# EAGLE schematic Flight-Mill-Controller (EAGLE 9.6.2)

## Sheet 1 of 3
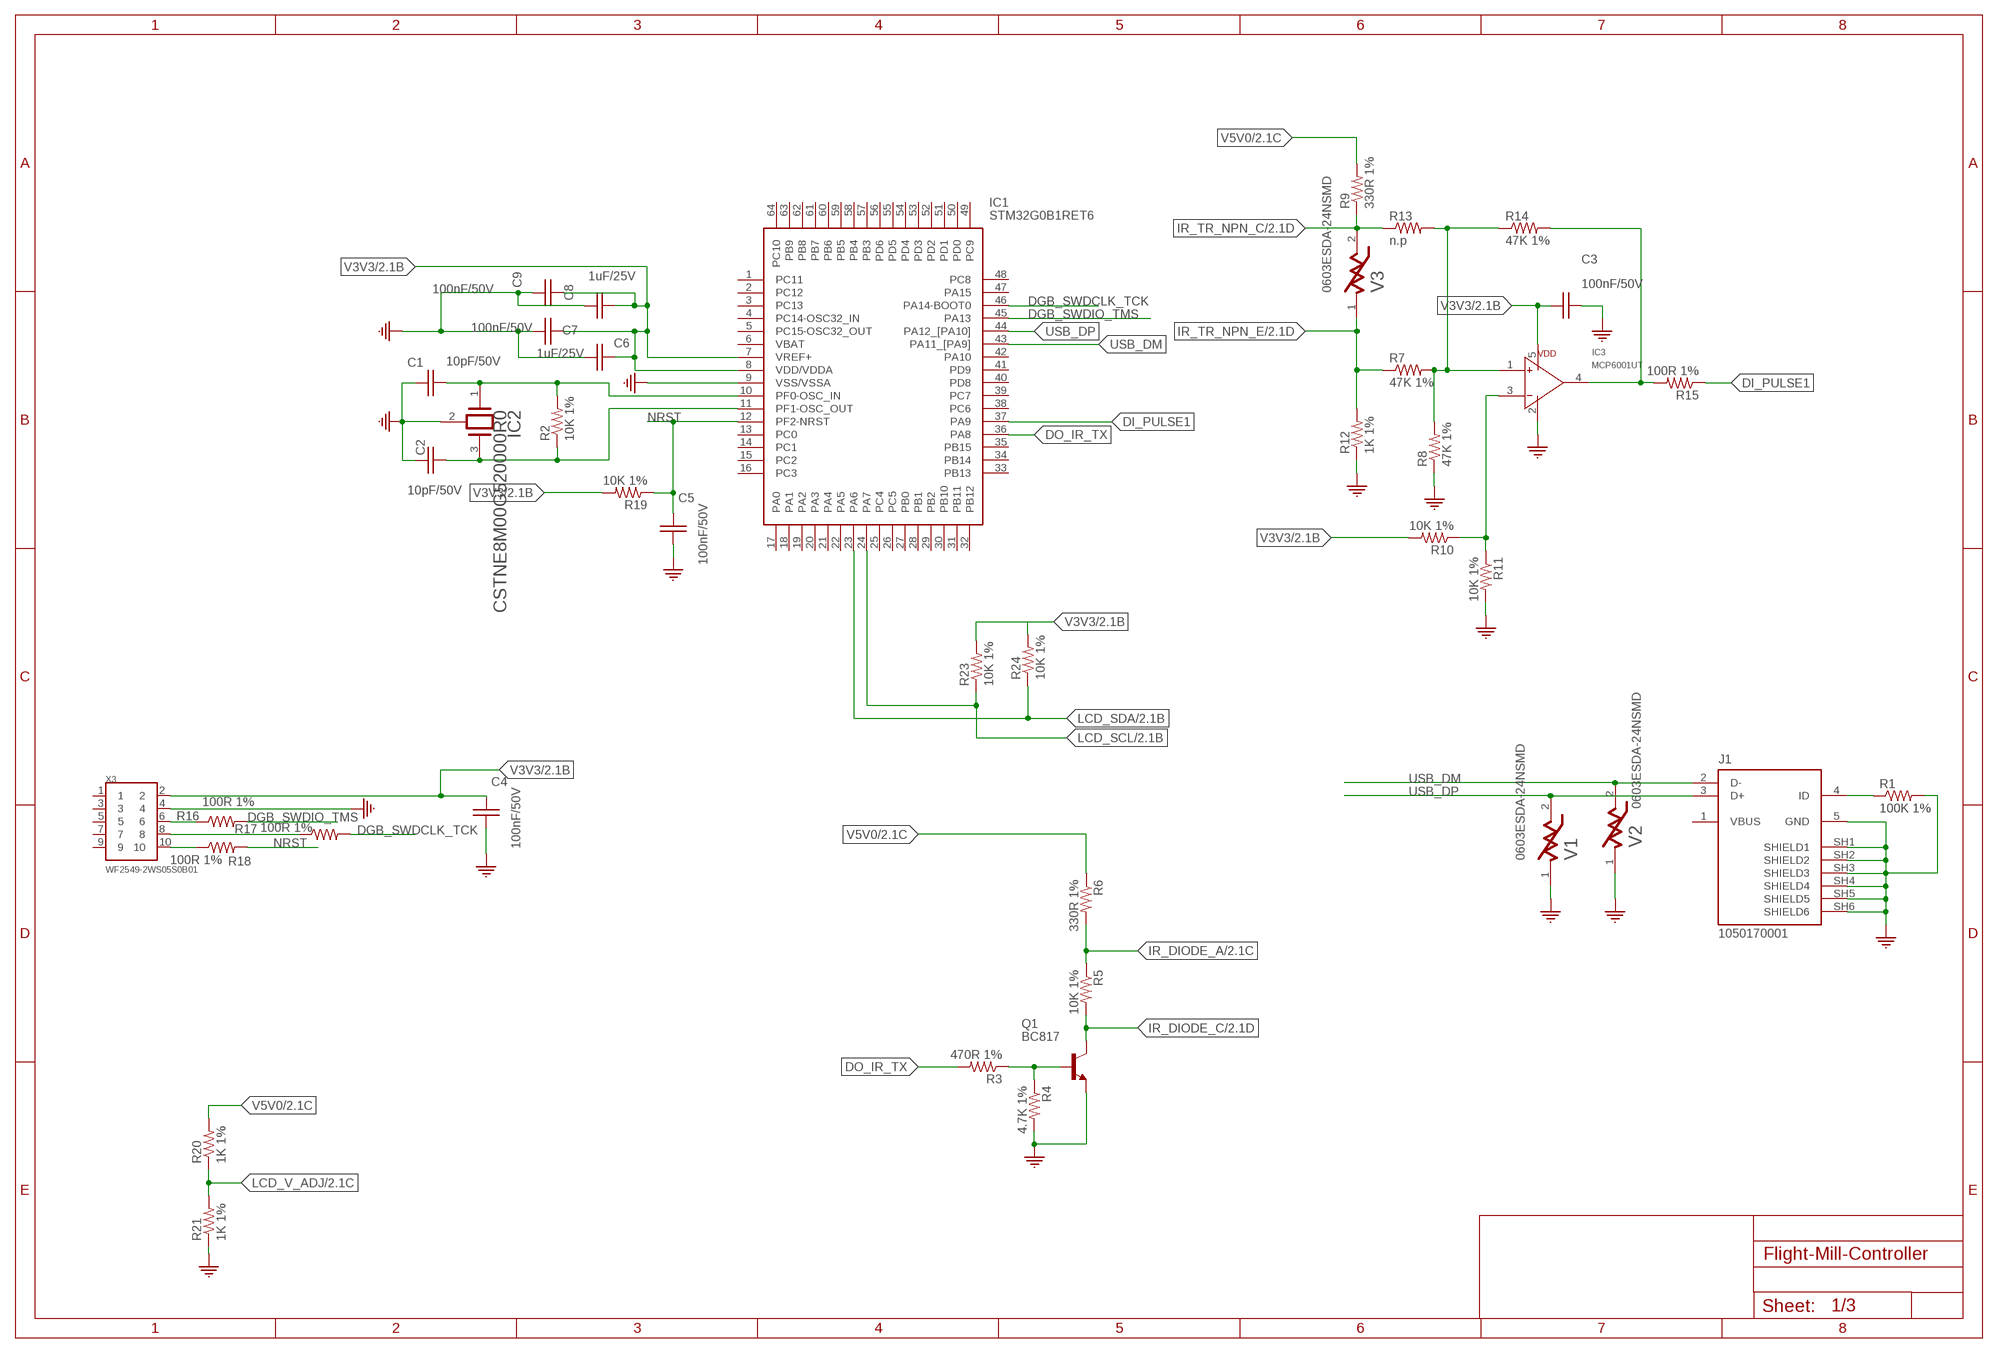
[diagram p0: schematic, sheet 1]

### Parts
C1  10pF/50V  C_0603EIA0603  [EIA0603]
C2  10pF/50V  C_0603EIA0603  [EIA0603]
C3  100nF/50V  C_0603EIA0603  [EIA0603]
C4  100nF/50V  C_0603EIA0603  [EIA0603]
C5  100nF/50V  C_0603EIA0603  [EIA0603]
C6  1uF/25V  C_0603EIA0603  [EIA0603]
C7  100nF/50V  C_0603EIA0603  [EIA0603]
C8  1uF/25V  C_0603EIA0603  [EIA0603]
C9  100nF/50V  C_0603EIA0603  [EIA0603]
IC1  STM32G0B1RET6  [QFP50P1200X1200X160-64N]
IC2  CSTNE8M00G520000R0  [CSTNE8M00G520000R0]
IC3  MCP6001UT  [SOT-23-5]
J1  1050170001  [MOLEX_1050170001]
Q1  BC817  [SOT23]
R1  100K 1%  R_0603  [EIA0603]
R2  10K 1%  R_0603  [EIA0603]
R3  470R 1%  R_0603  [EIA0603]
R4  4.7K 1%  R_0603  [EIA0603]
R5  10K 1%  R_0603  [EIA0603]
R6  330R 1%  R_0603  [EIA0603]
R7  47K 1%  R_0603  [EIA0603]
R8  47K 1%  R_0603  [EIA0603]
R9  330R 1%  R_0603  [EIA0603]
R10  10K 1%  R_0603  [EIA0603]
R11  10K 1%  R_0603  [EIA0603]
R12  1K 1%  R_0603  [EIA0603]
R13  n.p  R_0603  [EIA0603]
R14  47K 1%  R_0603  [EIA0603]
R15  100R 1%  R_0603  [EIA0603]
R16  100R 1%  R_0603  [EIA0603]
R17  100R 1%  R_0603  [EIA0603]
R18  100R 1%  R_0603  [EIA0603]
R19  10K 1%  R_0603  [EIA0603]
R20  1K 1%  R_0603  [EIA0603]
R21  1K 1%  R_0603  [EIA0603]
R23  10K 1%  R_0603  [EIA0603]
R24  10K 1%  R_0603  [EIA0603]
V1  0603ESDA-24NSMD  [EIA0603]
V2  0603ESDA-24NSMD  [EIA0603]
V3  0603ESDA-24NSMD  [EIA0603]
X3  WF2549-2WS05S0B01  [X10_100MIL_2XROW_VERT]

### Nets
DGB_SWDCLK_TCK: IC1.46(PA14-BOOT0) R17.2
DGB_SWDIO_TMS: IC1.45(PA13) R16.2
DI_PULSE1: IC1.37(PA9) R15.1
DO_IR_TX: IC1.36(PA8) R3.2
GND: C1.1 C2.1 C3.2 C4.1 C5.1 C6.2 C7.2 C8.2 C9.2 IC1.9(VSS/VSSA) IC2.2(GND) IC3.2(NULL) J1.5(GND) J1.SH1(SHIELD1) J1.SH2(SHIELD2) J1.SH3(SHIELD3) J1.SH4(SHIELD4) J1.SH5(SHIELD5) J1.SH6(SHIELD6) Q1.2(E) R1.2 R4.2 R8.1 R11.2 R12.1 R21.1 V1.1 V2.1 X3.4 ; also sheet 2,3
IR_DIODE_A: R5.1 R6.2 ; also sheet 2
IR_DIODE_C: Q1.3(C) R5.2 ; also sheet 2
IR_TR_NPN_C: R9.1 R13.1 V3.2 ; also sheet 2
IR_TR_NPN_E: R7.1 R12.2 V3.1 ; also sheet 2
LCD_SCL: IC1.24(PA7) R23.1 ; also sheet 2
LCD_SDA: IC1.23(PA6) R24.1 ; also sheet 2
LCD_V_ADJ: R20.1 R21.2 ; also sheet 2
N$1: R16.1 X3.6
N$3: C1.2 IC1.10(PF0-OSC_IN) IC2.1(INPUT) R2.2
N$4: J1.4(ID) R1.1
N$5: C2.2 IC1.11(PF1-OSC_OUT) IC2.3(OUTPUT) R2.1
N$6: IC3.1(NULL) R7.2 R8.2 R13.2 R14.1
N$7: Q1.1(B) R3.1 R4.1
N$8: IC3.3(NULL) R10.1 R11.1
N$10: IC3.4(NULL) R14.2 R15.2
N$11: R17.1 X3.8
N$13: R18.1 X3.10
NRST: C5.2 IC1.12(PF2-NRST) R18.2 R19.1
USB_DM: IC1.43(PA11_[PA9]) J1.2(D-) V2.2
USB_DP: IC1.44(PA12_[PA10]) J1.3(D+) V1.2
V3V3: C3.1 C4.2 C6.1 C7.1 C8.1 C9.1 IC1.7(VREF+) IC1.8(VDD/VDDA) IC3.5(NULL) R10.2 R19.2 R23.2 R24.2 X3.2 ; also sheet 2
V5V0: R6.1 R9.2 R20.2 ; also sheet 2,3
Unconnected: IC1.1(PC11) IC1.2(PC12) IC1.3(PC13) IC1.4(PC14-OSC32_IN) IC1.5(PC15-OSC32_OUT) IC1.6(VBAT) IC1.13(PC0) IC1.14(PC1) IC1.15(PC2) IC1.16(PC3) IC1.17(PA0) IC1.18(PA1) IC1.19(PA2) IC1.20(PA3) IC1.21(PA4) IC1.22(PA5) IC1.25(PC4) IC1.26(PC5) IC1.27(PB0) IC1.28(PB1) IC1.29(PB2) IC1.30(PB10) IC1.31(PB11) IC1.32(PB12) IC1.33(PB13) IC1.34(PB14) IC1.35(PB15) IC1.38(PC6) IC1.39(PC7) IC1.40(PD8) IC1.41(PD9) IC1.42(PA10) IC1.47(PA15) IC1.48(PC8) IC1.49(PC9) IC1.50(PD0) IC1.51(PD1) IC1.52(PD2) IC1.53(PD3) IC1.54(PD4) IC1.55(PD5) IC1.56(PD6) IC1.57(PB3) IC1.58(PB4) IC1.59(PB5) IC1.60(PB6) IC1.61(PB7) IC1.62(PB8) IC1.63(PB9) IC1.64(PC10) X3.1 X3.3 X3.5 X3.7 X3.9

## Sheet 2 of 3
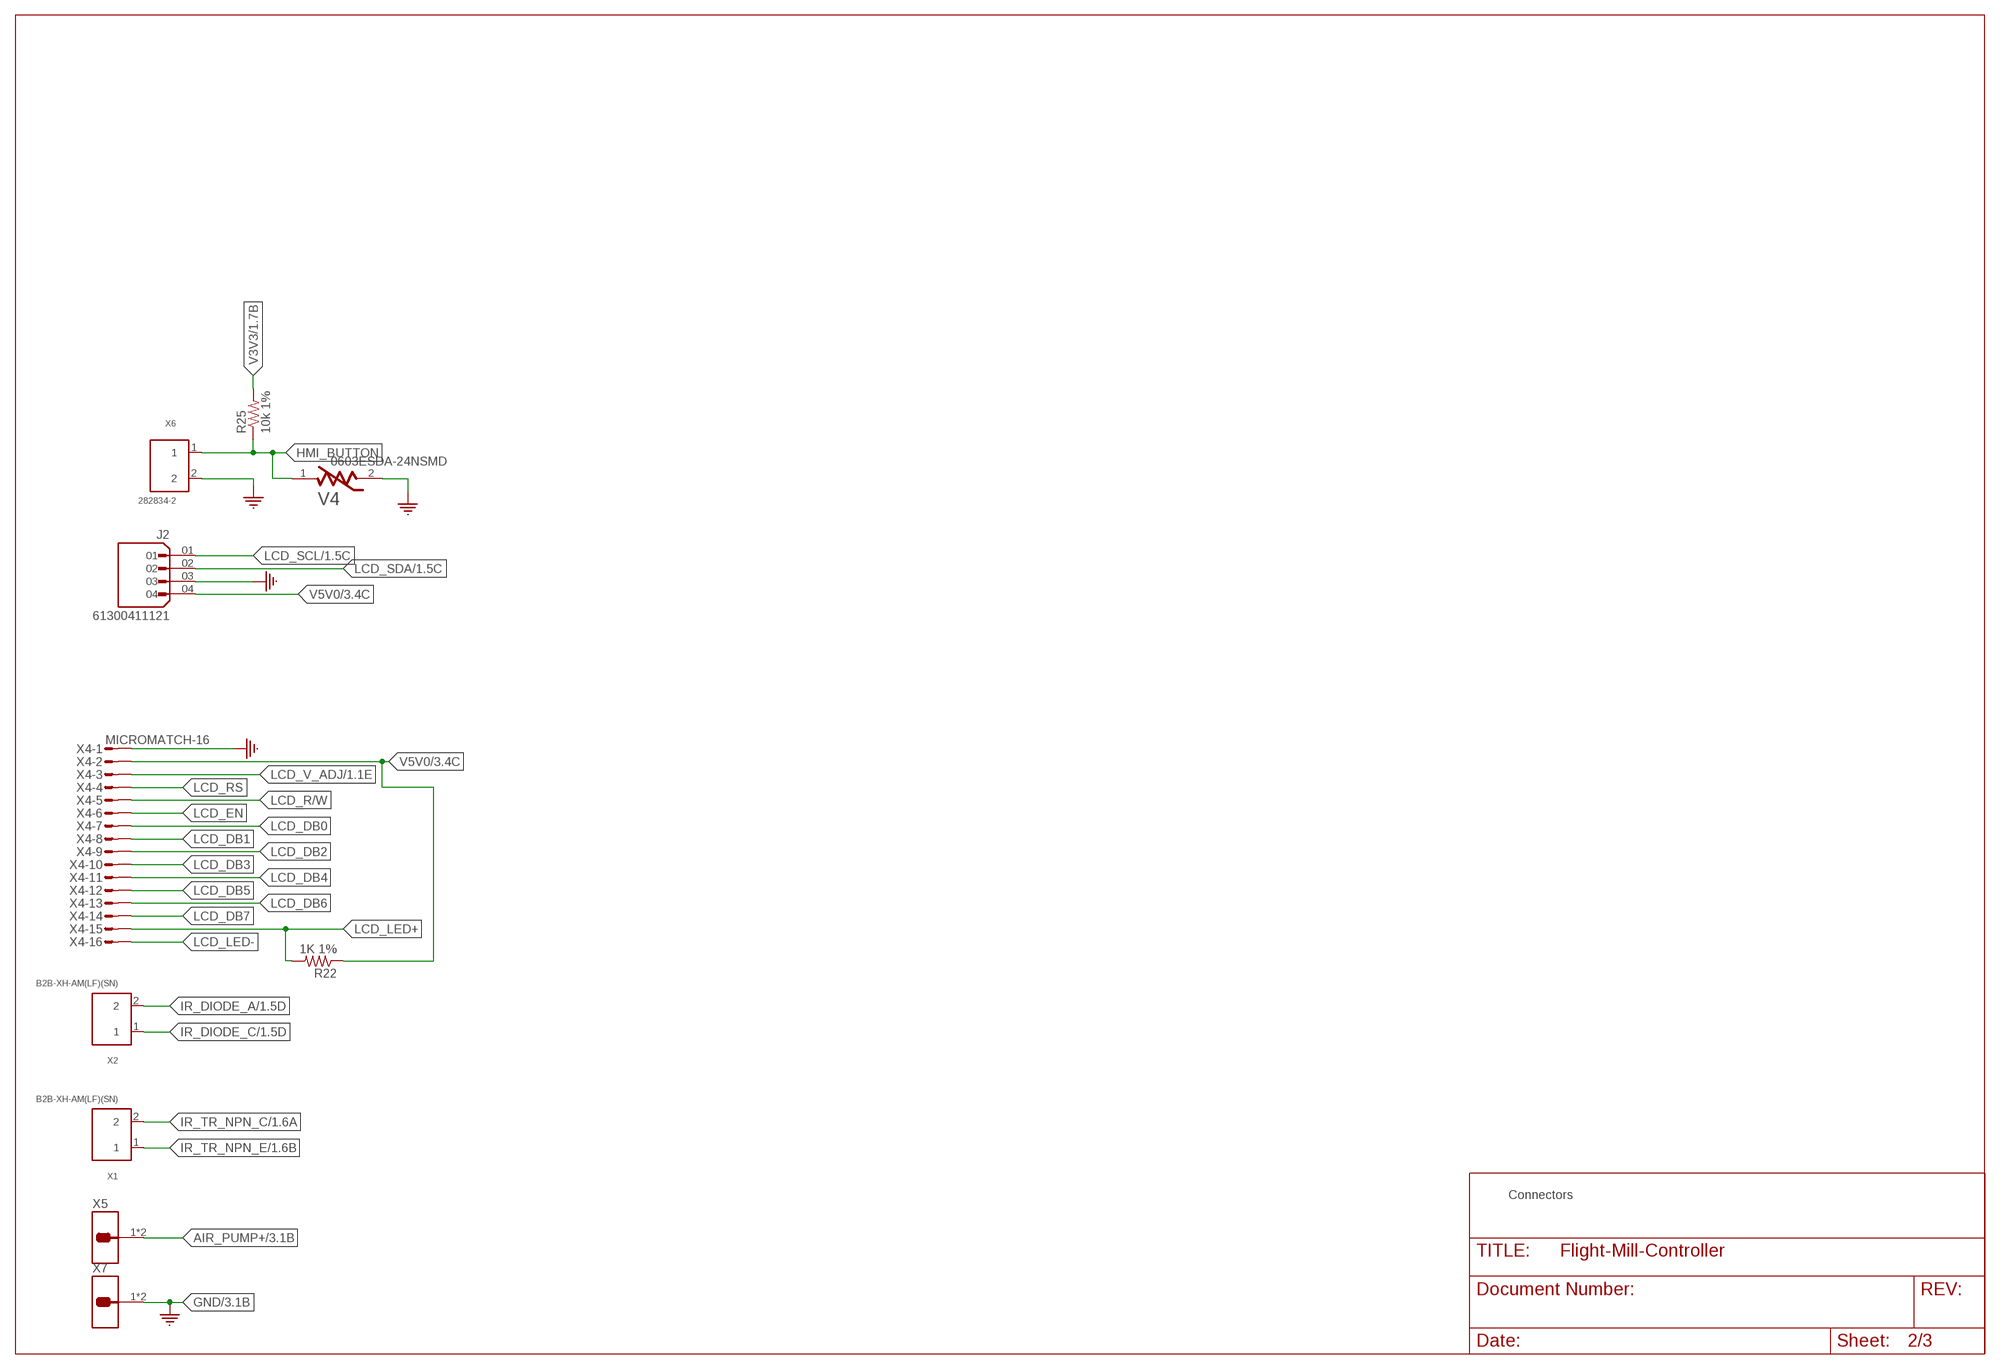
[diagram p1: schematic, sheet 2]
FRAME2 (DINA3_L): SHEETNAME: Connectors

### Parts
J2  61300411121  [X04_100MIL_1ROW]
R22  1K 1%  R_0603  [EIA0603]
R25  10k 1%  R_0603  [EIA0603]
V4  0603ESDA-24NSMD  [EIA0603]
X1  B2B-XH-AM(LF)(SN)  [B2B-XH-AM(LF)(SN)]
X2  B2B-XH-AM(LF)(SN)  [B2B-XH-AM(LF)(SN)]
X4  MICROMATCH-16  [MICROMATCH-16]
X5  726386-2TE_726386-2  [TE_726386-2]
X6  282834-2  [TE_282834-2_0]
X7  726386-2TE_726386-2  [TE_726386-2]

### Nets
AIR_PUMP+ [LV]: X5.1 X5.1-2 ; also sheet 3
GND: J2.03 V4.2 X4.1 X6.2 X7.1 X7.1-2 ; also sheet 1,3
HMI_BUTTON: R25.1 V4.1 X6.1
IR_DIODE_A: X2.2 ; also sheet 1
IR_DIODE_C: X2.1 ; also sheet 1
IR_TR_NPN_C: X1.2 ; also sheet 1
IR_TR_NPN_E: X1.1 ; also sheet 1
LCD_DB0: X4.7
LCD_DB1: X4.8
LCD_DB2: X4.9
LCD_DB3: X4.10
LCD_DB4: X4.11
LCD_DB5: X4.12
LCD_DB6: X4.13
LCD_DB7: X4.14
LCD_EN: X4.6
LCD_LED+: R22.2 X4.15
LCD_LED-: X4.16
LCD_R/W: X4.5
LCD_RS: X4.4
LCD_SCL: J2.01 ; also sheet 1
LCD_SDA: J2.02 ; also sheet 1
LCD_V_ADJ: X4.3 ; also sheet 1
V3V3: R25.2 ; also sheet 1
V5V0: J2.04 R22.1 X4.2 ; also sheet 1,3

## Sheet 3 of 3
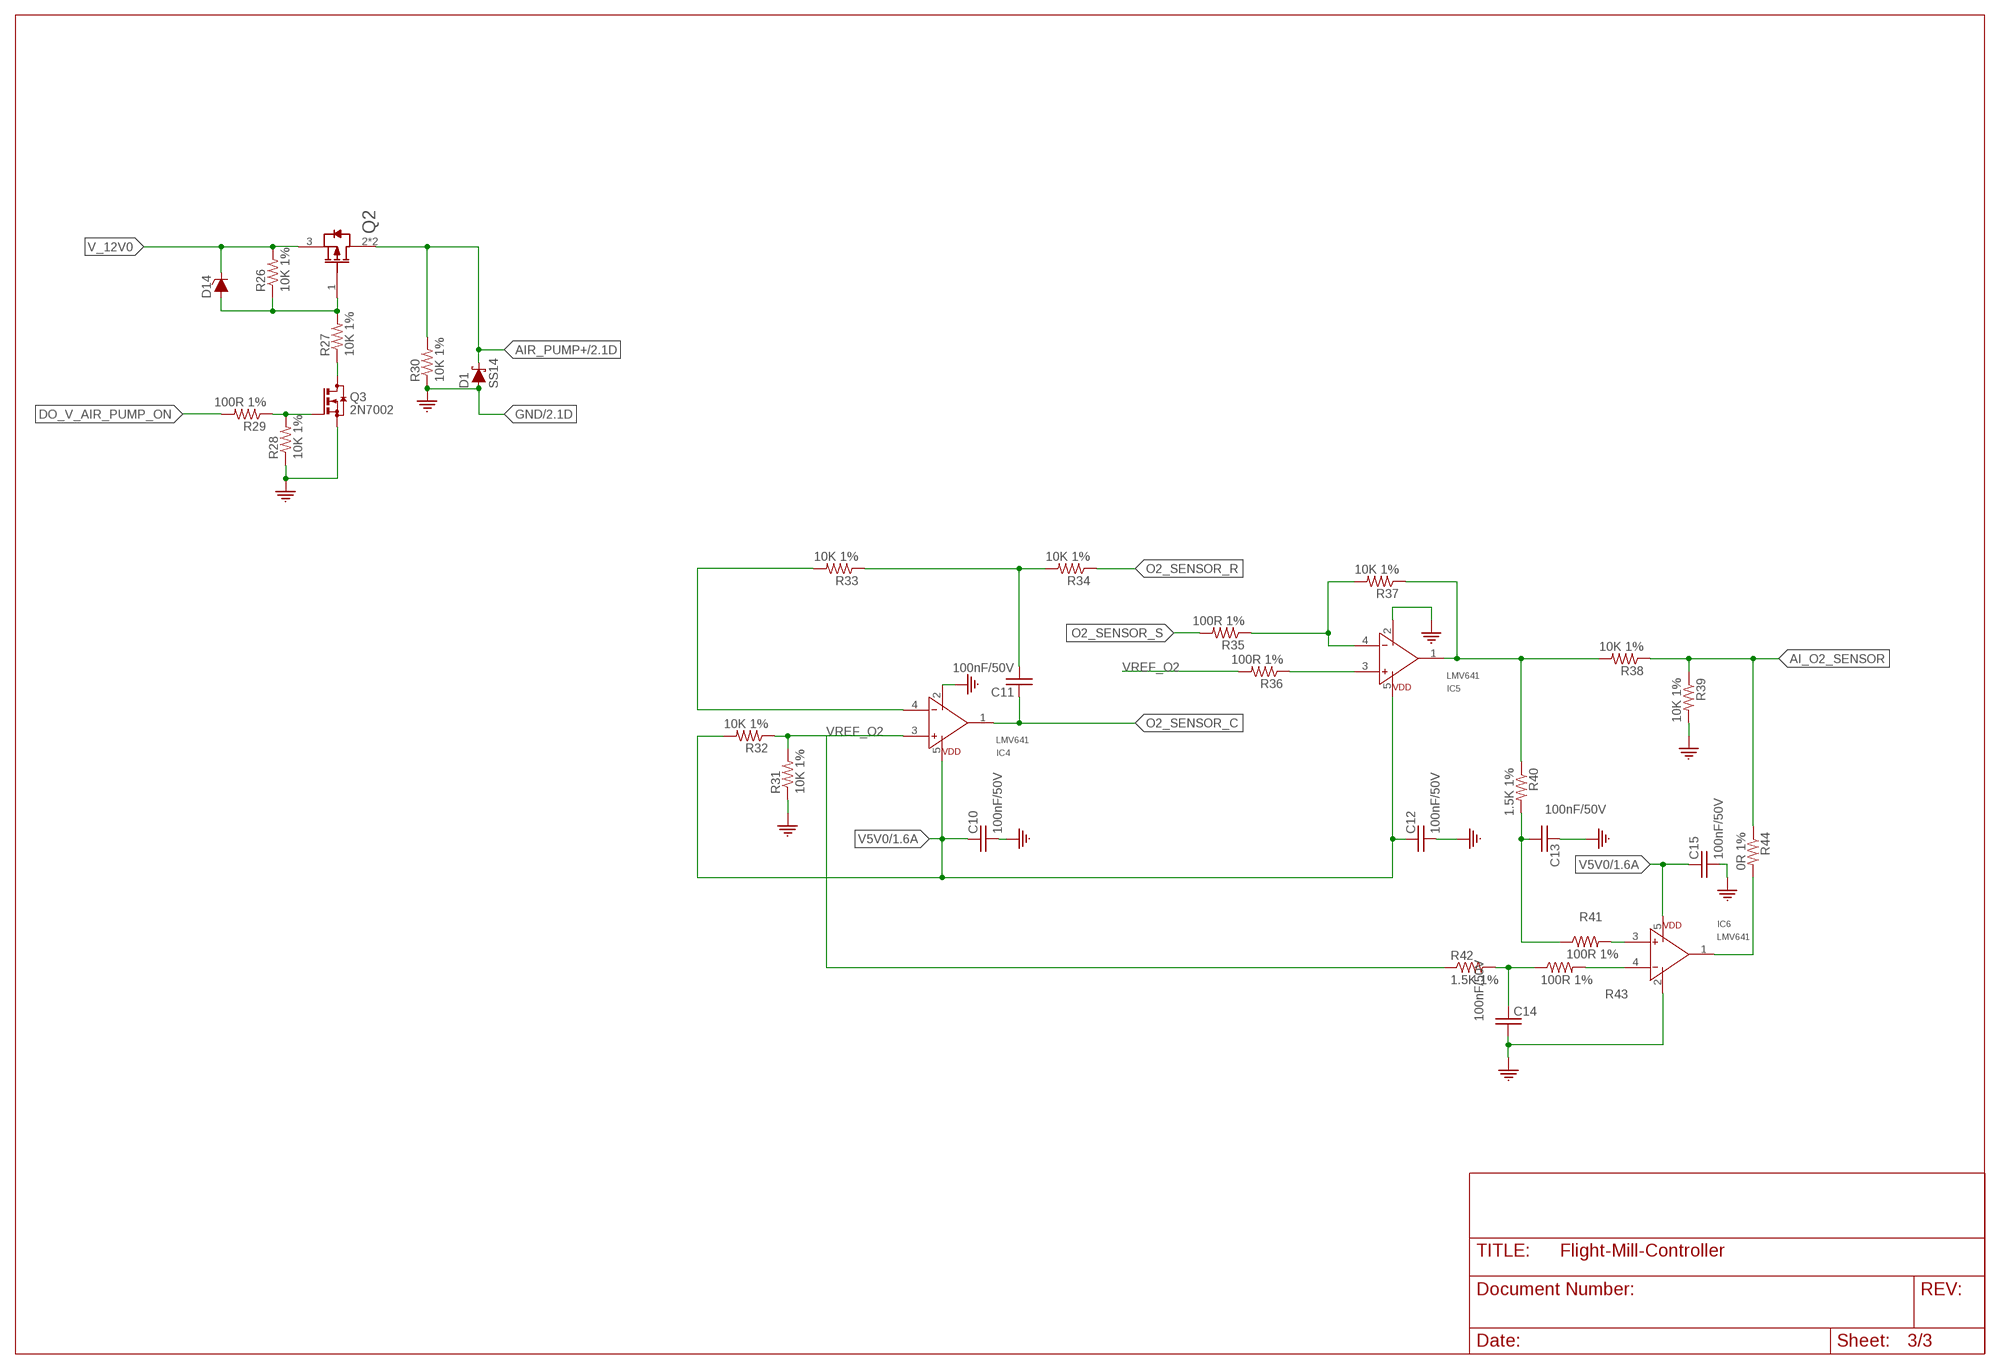
[diagram p2: schematic, sheet 3]

### Parts
C10  100nF/50V  C_0603EIA0603  [EIA0603]
C11  100nF/50V  C_0603EIA0603  [EIA0603]
C12  100nF/50V  C_0603EIA0603  [EIA0603]
C13  100nF/50V  C_0603EIA0603  [EIA0603]
C14  100nF/50V  C_0603EIA0603  [EIA0603]
C15  100nF/50V  C_0603EIA0603  [EIA0603]
D1  SS14  [SMA]
D14  MMBZ4696-HE3-18  [SOT23-3]
IC4  LMV641  [SOT-23-5]
IC5  LMV641  [SOT-23-5]
IC6  LMV641  [SOT-23-5]
Q2  UT2955G-AA3-R  [SOT223]
Q3  2N7002  [SOT23]
R26  10K 1%  R_0603  [0603]
R27  10K 1%  R_0603  [0603]
R28  10K 1%  R_0603  [0603]
R29  100R 1%  R_0603  [0603]
R30  10K 1%  R_0603  [0603]
R31  10K 1%  R_0603  [0603]
R32  10K 1%  R_0603  [0603]
R33  10K 1%  R_0603  [0603]
R34  10K 1%  R_0603  [0603]
R35  100R 1%  R_0603  [0603]
R36  100R 1%  R_0603  [0603]
R37  10K 1%  R_0603  [0603]
R38  10K 1%  R_0603  [0603]
R39  10K 1%  R_0603  [0603]
R40  1.5K 1%  R_0603  [0603]
R41  100R 1%  R_0603  [0603]
R42  1.5K 1%  R_0603  [0603]
R43  100R 1%  R_0603  [0603]
R44  0R 1%  R_0603  [0603]

### Nets
AI_O2_SENSOR: IC5.1(OUT) R37.1 R38.1 R38.2 R39.1 R40.1 R44.1
AIR_PUMP+ [LV]: D1.1(C) Q2.2(DRAIN) Q2.4(DRAIN) R30.2 ; also sheet 2
DO_V_AIR_PUMP_ON [LV]: R29.2
GND: C10.2 C12.2 C13.1 C14.2 C15.2 D1.2(A) IC4.2(VEE) IC5.2(VEE) IC6.2(VEE) Q3.2(S) R28.1 R30.1 R31.1 R39.2 ; also sheet 1,2
N$2 [LV]: D14.1(A) Q2.1(GATE) R26.1 R27.2
N$9 [LV]: Q3.3(D) R27.1
N$12 [LV]: Q3.1(G) R28.2 R29.1
N$14: IC5.4(IN-) R35.1 R37.2
N$15: C13.2 R40.2 R41.1
N$16: C11.2 R33.1 R34.2
N$17: IC4.4(IN-) R33.2
N$18: IC6.3(IN+) R41.2
N$19: IC5.3(IN+) R36.1
N$20: IC6.4(IN-) R43.2
N$21: C14.1 R42.2 R43.1
N$22: IC6.1(OUT) R44.2
O2_SENSOR_C: C11.1 IC4.1(OUT)
O2_SENSOR_R: R34.1
O2_SENSOR_S: R35.2
V5V0: C10.1 C12.1 C15.1 IC4.5(VCC) IC5.5(VCC) IC6.5(VCC) R32.2 ; also sheet 1,2
V_12V0 [LV]: D14.3(C) Q2.3(SOURCE) R26.2
VREF_O2: IC4.3(IN+) R31.2 R32.1 R36.2 R42.1

## Power pins joined to a net without a drawn wire
VBUS: J1.1(VBUS)

## Library data of the parts
C1-C15 = Labops_Lib_AH:C_0603
D1 = Labops_Lib_AH:SS14; DESCRIPTION: Diode Schottky 1A/40V (SMA); LIB_STATUS: Prototype; MFN: SS14-LTP; MFR: MCC; OUR_STOCK: 10; PART_VALUE: Schottky 1A/40V; PRICE-1: 0.05; SUPPLIER-1: LCSC
D14 = Labops_Lib_AH:MMBZ4696-HE3-18: Zener 9.1 Volt 0.225W 5%; DESCRIPTION: Zener Diodes 9.1 Volt 0.225W 5% AUTO; MFN: MMBZ4696-HE3-18; MFR: Vishay; OUR_STOCK: 500; PART_VALUE: 9V 5%; PRICE-1: 0.06; SUPPLIER-1: Mouser
IC1 = Labops_Lib_AH:STM32G0B1RET6: Mainstream Arm Cortex-M0+ 32-bit MCU, up to 512KB Flash, 144KB RAM, 6x USART, timers, ADC, DAC, comm. I/Fs, 1.7-3.6V Source: Datasheet <https://www.st.com/resource/en/datasheet/stm32g0b1cc.pdf>; ARROW_PART_NUMBER: STM32G0B1RET6; ARROW_PRICE-STOCK: https://www.arrow.com/en/products/stm32g0b1ret6/stmicroelectronics?region=nac; DESCRIPTION: Mainstream Arm Cortex-M0+ 32-bit MCU, up to 512KB Flash, 144KB RAM, 6x USART, timers, ADC, DAC, comm. I/Fs, 1.7-3.6V; HEIGHT: 1.6mm; MANUFACTURER_NAME: STMicroelectronics; MANUFACTURER_PART_NUMBER: STM32G0B1RET6; MOUSER_PART_NUMBER: 511-STM32G0B1RET6; MOUSER_PRICE-STOCK: https://www.mouser.co.uk/ProductDetail/STMicroelectronics/STM32G0B1RET6?qs=pUKx8fyJudDnJgtz7LZZ0A%3D%3D
IC2 = Labops_Lib_AH:CSTNE8M00G520000R0: 8.000MHz ±0.50% Ceramic Resonator with Built in Capacitor 10pF 40Ω Stability ±0.20% 3-SMD; DESCRIPTION: 8MHz ±0.5% 10pF 40Ω SMD3213-3P Ceramic Resonators; LIB_STATUS: Prototype; MFN: CSTNE8M00G520000R0; MFR: Murata; PART_VALUE: 8MHz, 0.5%; PRICE-1: 0.12; SUPPLIER-1: LCSC
IC3 = Labops_Lib_AH:MCP6001UT: Opamp, 1MHz, SOT23-5, One Channel, Rail-Rail
IC4-IC6 = Labops_Lib_AH:LMV641: Opamp, 1MHz, SOT23-5, One Channel, Rail-Rail; DESCRIPTION: 1CH 10MHz 1 Low power 2.3 V/us 2.7V~12V SOT-23-5 OpAmp; MFN: LMV641MF/NOPB; MFR: Texas Instruments; PACKAGE: SOT23-5; PART_VALUE: LMV641
J1 = Labops_Lib_AH:1050170001: Check availability <https://pricing.snapeda.com/parts/1050170001/Molex/view-part?ref=eda>; AVAILABILITY: In Stock; CHECK_PRICES: https://www.snapeda.com/parts/1050170001/Molex/view-part/?ref=eda; DESCRIPTION: USB - micro B USB 2.0 Receptacle Connector 5 Position Surface Mount, Right Angle; Through Hole; MF: Molex; MP: 1050170001; PACKAGE: None; PRICE: None; PURCHASE-URL: https://www.snapeda.com/api/url_track_click_mouser/?unipart_id=2755530&manufacturer=Molex&part_name=1050170001&search_term=None; SNAPEDA_LINK: https://www.snapeda.com/parts/1050170001/Molex/view-part/?ref=snap
J2 = Labops_Lib_AH:61300411121: Check availability <https://pricing.snapeda.com/parts/61300411121/W%C3%BCrth%20Elektronik/view-part?ref=eda> Check availability <https://pricing.snapeda.com/parts/61300411121/Wurth%20Electronics/view-part?ref=eda>; DESCRIPTION: Connector Header Through Hole 4 position 0.100 (2.54mm); MFN: 61300411121; MFR: Wurth Electronics
Q1 = Labops_Lib_AH:BC817; DESCRIPTION: Transistor BJT NPN SOT23 45V 0.5A; MFN: BC817; MFR: NXP; PRICE-1: 0.03; SUPPLIER-1: Mouser
Q2 = Labops_Lib_AH:UT2955G-AA3-R: PMOSFET, SOT-223, 60V, 1.7A; DESRIPTION: PMOSFET 60V, 1.7A, SOT223; MFN: UT2955G-AA3-R; MFR: UTC; OUR_STOCK: 100; PART_VALUE: UT2955G; PRICE-1: 0.18; SUPPLIER-1: LCSC
Q3 = Labops_Lib_AH:2N7002; DESCRIPTION: NMOSFET, 500mA, 60V, Vth 2.5V; LIB_STATUS: Prototype; MFN: 2N7002; MFR: Diodes, Guangdong Hotetech,NXP; OUR_STOCK: 100; PART_VALUE: NMOSFET; PRICE-1: 0.02; SUPPLIER-1: LCSC
R1-R25 = Labops_Lib_AH:R_0603; MFN: Open Source 0603
R26-R44 = 3D_MIG_Controller:R_0603
V1-V4 = Labops_Lib_AH:0603ESDA-24N; DESCRIPTION: aristor 0603 SMD Bidirectional 50V 24V; MFN: 0603ESDA-24N; MFR: Bourns; SUPPLIER-1: LCSC
X1 X2 = Labops_Lib_AH:B2B-XH-AM(LF)(SN); DESCRIPTION: Connector, 2 pins, Header THT , Pitch 2.5mm, JST, Vertical; MFN: B2B-XH-AM(LF)(SN); MFR: JST; PRICE-1: 0.03; SUPPLIER-1: LCSC; TECHNOLOGY: THT
X3 = Labops_Lib_AH:WF2549-2WS05S0B01; DESCRIPTION: X10, 10 Pins, Header, Pitch 2.54 wire to board 2xrows, THT; MFN: WF2549-2WS05S0B01; MFR: WCON; PRICE-1: 0.25; SUPPLIER-1: LCSC
X4 = con-amp-micromatch:MICROMATCH-16: MicroMaTch 16 8-215464-6 / 1-215464-6 Drawing Number C-215464 DDEController.pdf; MF: FARNELL; MPN: 8-215464-6; OC_FARNELL: 3784680; OC_NEWARK: 26H3309
X5 X7 = Labops_Lib_AH:726386-2: Terminals, Faston, GDS-Flachstecker 6.3x0.8mm, TE; CENTROID_NOT_SPECIFIED: No; CONN_GENDER: Male; CONN_ORIENTATION: Straight; CONTACT_MATERIAL: Tin; DATASHEET: http://www.te.com/commerce/DocumentDelivery/DDEController?Action=showdoc&DocId=Customer+Drawing%7F726386%7FG%7Fpdf%7FEnglish%7FENG_CD_726386_G.pdf%7F726386-2; DEVICE_CLASS_L1: Connectors; DEVICE_CLASS_L2: Terminal Blocks | Terminals; DEVICE_CLASS_L3: unset; DIGIKEY_DESCRIPTION: CONN QC TAB 0.250 SOLDER; DIGIKEY_PART_NUMBER: A114371-ND; HEIGHT: 10mm; LEAD_FREE: yes; MF: TE; MFG_PACKAGE_IDENT: 726386-2; MFG_PACKAGE_IDENT_DATE: 0; MFG_PACKAGE_IDENT_REV: 0; MOUSER_DESCRIPTION: Terminals GDS-FLACHSTECK 6.3; MOUSER_PART_NUMBER: 571-726386-2; MPN: 726386-2; PACKAGE: PTH_TERMINAL_8MM0_0MM8; PREFIX: J; ROHS: yes; TEMPERATURE_RANGE_HIGH: +110°C; TEMPERATURE_RANGE_LOW: -30°C; VERIFICATION_VERSION: 0.0.0.1
X6 = Labops_Lib_AH:282834-2; DESCRIPTION: Connector Header Terminal Block 2 Positions, 1 Row, 2.54mm, THT; MFN: 282834-2; MFR: TE; PRICE-1: 0.8; SUPPLIER-1: Digikey

## Net classes
3 LV: clearance 8 mm to class 1